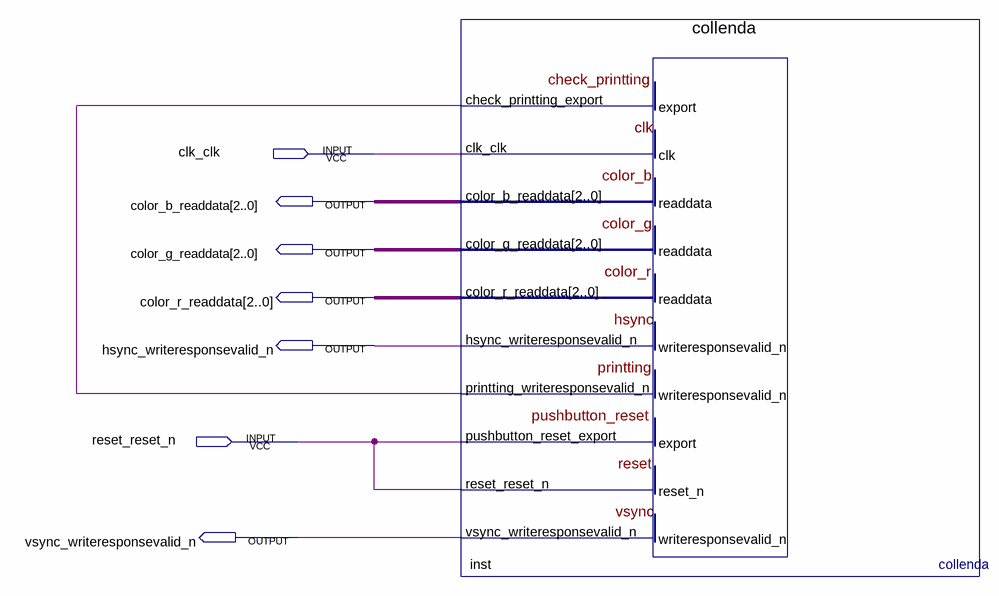
[diagram p0: schematic sheet]
// Quartus schematic consoleCollenda.bdf as structural Verilog: 1 symbols, 7 pins
module consoleCollenda (
  input  clk_clk,
  input  reset_reset_n,
  output [2:0] color_b_readdata,
  output [2:0] color_g_readdata,
  output [2:0] color_r_readdata,
  output hsync_writeresponsevalid_n,
  output vsync_writeresponsevalid_n
);

  wire inst_printting_writeresponsevalid_n;

  collenda inst (
    .check_printting_export(inst_printting_writeresponsevalid_n), .clk_clk(clk_clk),
    .pushbutton_reset_export(reset_reset_n), .reset_reset_n(reset_reset_n),
    .color_b_readdata(color_b_readdata), .color_g_readdata(color_g_readdata),
    .color_r_readdata(color_r_readdata), .hsync_writeresponsevalid_n(hsync_writeresponsevalid_n),
    .printting_writeresponsevalid_n(inst_printting_writeresponsevalid_n),
    .vsync_writeresponsevalid_n(vsync_writeresponsevalid_n));
endmodule
